# Altium schematic sheet PSU.SchDoc: Top Level
size A3; CompanyName: NOT USED; SheetNumber: 0; SheetTotal: 0; PageSetup: Record=PageOptions|CenterHorizontal=True|CenterVertical=True|PrintScale=1.00|XCorrection=1.00|YCorrection=1.00|PrintKind=0|BorderSize=5000000|LeftOffset=0|BottomOffset=0|Orientation=2|PaperLength=1000|PaperWidth=1000|Scale=100|PaperSource=7|PrintQuality=-4|MediaType=1|DitherType=10|PaperKind=A3|PrintScaleMode=0
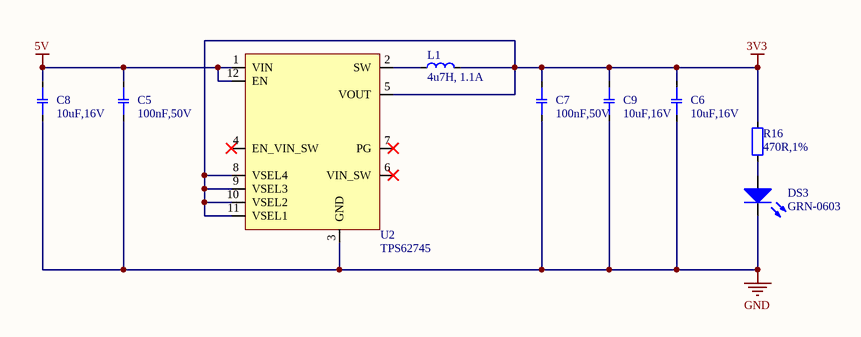
[diagram p0: PSU.SchDoc]

## Parts
C5  100nF,50V  [CAPC1608X09N_0603]
C6  10uF,16V  [CAPC2012X12N_0805]
C7  100nF,50V  [CAPC1608X09N_0603]
C8  10uF,16V  [CAPC2012X12N_0805]
C9  10uF,16V  [CAPC2012X12N_0805]
DS3  GRN-0603  [LED_SML-LX0603]
L1  4u7H, 1.1A  [INDC2520X12N_1008]
R16  470R,1%  [RESC1608X06N_0603]
U2  TPS62745  [R-PWSON-N12]

## Nets
3V3: C6.2 C7.2 C9.2 L1.2 R16.2 U2.5(VOUT) U2.8(VSEL4) U2.9(VSEL3) U2.10(VSEL2) U2.11(VSEL1)
5V: C5.2 C8.2 U2.1(VIN) U2.12(EN)
GND: C5.1 C6.1 C7.1 C8.1 C9.1 DS3.1(C) U2.3(GND)
NetDS3_2: DS3.2(A) R16.1
NetL1_1: L1.1 U2.2(SW)

Not connected (* = marked no-connect by the designer): U2 4(EN_VIN_SW)* 6(VIN_SW)* 7(PG)*

## Notes on the sheet
- Project
- Size:
- Date:
- A3
- Revision:
- Sheet
- of
- Lambo
- File:

## Library data of the parts
C5 C7 = CCH-104CH-G: CAP CER 0.1UF 50V 10% X7R 0603; Manufacturer: Kemet; Manufacturer Part Number: C0603C104K5RACTU; Type: Ceramic; Display_Name: 100nF,50V; Capacitance: 100nF; Dielectric: X7R; Tolerance: 10%; Voltage: 50V; BWA PN: CCH-104CH-G; Schematic Symbol: CAP-NP_1; Supplier 1: Digi-Key; Supplier Part Number 1: 399-5089-1-ND
C6 C8 C9 = CCI-106CD-G: CAP CER 10µF ±10% 16V X7R 0805; Manufacturer: Samsung Electro-Mechanics America, Inc.; Manufacturer Part Number: CL21B106KOQNNNG; Type: Ceramic; Display_Name: 10uF,16V; Capacitance: 10uF; Dielectric: X7R; Tolerance: 10%; Voltage: 16V; BWA PN: CCI-106CD-G; Schematic Symbol: CAP-NP_1; Supplier 1: Digi-Key; Supplier Part Number 1: 1276-6472-1-ND
DS3 = LED-10087-A: LED GREEN CLEAR 0603 SMD; Manufacturer: Dialight; Manufacturer Part Number: 5988081107F; Wavelength: 523nm; Axial Intensity: 300mcd; If(max): 20mA; Lens Style/Size: 0603; Vf@I: 3.2V; Viewing Angle: 140; Display_Name: GRN-0603; BWA PN: LED-10087-A; Colour: GREEN; Lens type: clear; Vr(max): -; Schematic Symbol: LED_1; Supplier 1: Digi-Key; Supplier Part Number 1: 350-2036-1-ND
L1 = IND-10165-A: INDUCTOR POWER 4.7UH 1.1A SMD; Manufacturer: Murata Electronics North America; Manufacturer Part Number: DFE252010R-H-4R7M=P2; Sheilding: Unsheilded; Type: Wirewound; DC Resistance: 276mOhm; Display_Name: 4u7H, 1.1A; Inductance: 4u7H; BWA PN: IND-10165-A; Current Rating: 1.1A; Schematic Symbol: INDUCTOR_1; Supplier 1: Digi-Key; Supplier Part Number 1: 490-10646-1-ND
R16 = RSH-470R0-D: RES 470 OHM 1/10W 1% 0603 SMD; Manufacturer: Rohm Semiconductor; Manufacturer Part Number: MCR03EZPFX4700; Power: 0.1W; Display_Name: 470R,1%; Resistance: 470R; Tolerance: 1%; Type: Chip; BWA PN: RSH-470R0-D; Schematic Symbol: RESISTOR_1; Supplier 1: Digi-Key; Supplier Part Number 1: RHM470HCT-ND
U2 = ICT-10699-A: Step Down Converter; Manufacturer: Texas Instruments; Temp Range: -40°C ~ 85°C; Display_Name: TPS62745; BWA PN: ICT-10699-A; Schematic Symbol: TPS62745; Manufacturer Part Number: TPS62745; Supplier 1: Digi-Key; Supplier Part Number 1: 296-44339-1-ND; Supplier 2: Element 14; Supplier Part Number 2: 2498474